# EAGLE design espscrew12e (EAGLE 7.6.0)
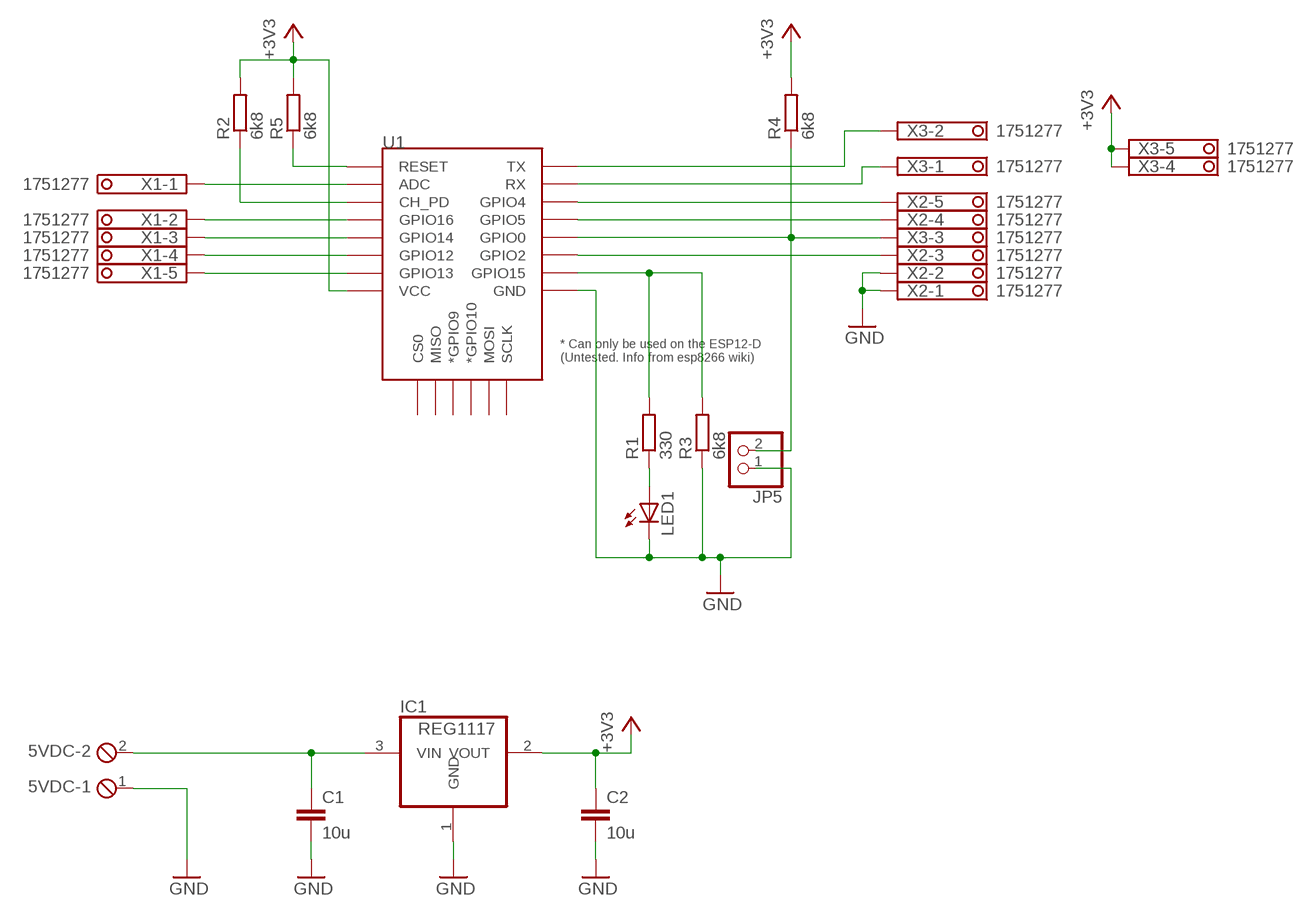
[diagram p0: schematic, sheet 1]

## Parts
5VDC  MPT2  [2POL254]
C1  10u  C-EUC1206K  [C1206K]
C2  10u  C-EUC1206K  [C1206K]
IC1  REG1117  [SOT223]
JP5  PINHD-1X2  [1X02]
LED1  LEDSML1206  [SML1206]
R1  330  R-EU_R1206  [R1206]
R2  6k8  R-EU_R1206  [R1206]
R3  6k8  R-EU_R1206  [R1206]
R4  6k8  R-EU_R1206  [R1206]
R5  6k8  R-EU_R1206  [R1206]
U1  ESP12ESMD  [ESP12E-SMD]
X1  1751277  [1751277]
X2  1751277  [1751277]
X3  1751277  [1751277]

## Nets
+3V3: C2.1 IC1.2(VOUT) R2.2 R4.2 R5.2 U1.VCC X3.4 X3.5
GND: 5VDC.1 C1.2 C2.2 IC1.1(GND) JP5.1 LED1.C R3.1 U1.GND X2.1 X2.2
N$1: 5VDC.2 C1.1 IC1.3(VIN)
N$2: LED1.A R1.1
N$3: R5.1 U1.RESET
N$4: U1.ADC X1.1
N$5: R2.1 U1.CH_PD
N$6: U1.GPIO16 X1.2
N$7: U1.GPIO14 X1.3
N$8: U1.GPIO12 X1.4
N$9: U1.GPIO13 X1.5
N$11: U1.TXD0(TX) X3.2
N$12: U1.RXD0(RX) X3.1
N$13: U1.GPIO4 X2.5
N$14: U1.GPIO5 X2.4
N$15: JP5.2 R4.1 U1.GPIO0 X3.3
N$16: U1.GPIO2 X2.3
N$17: R1.2 R3.2 U1.GPIO15
Unconnected: U1.CS0 U1.GPIO9(*GPIO9) U1.GPIO10(*GPIO10) U1.MISO U1.MOSI U1.SCLK

## Library data of the parts
5VDC = con-phoenix-254:MPT2: PHOENIX CONNECTOR; OC_FARNELL: unknown; OC_NEWARK: unknown
C1 C2 = rcl:C-EU: CAPACITOR, European symbol
IC1 = burr-brown:REG1117: 800mA and 1A Low Dropout (LDO) Positive Regulator 1.8V, 2.5V, 2.85V, 3.3V, 5V, and Adj; MPN: REG1117; OC_FARNELL: 1097566; OC_NEWARK: 14P6981
JP5 = pinhead:PINHD-1X2: PIN HEADER
LED1 = led:LED: LED OSRAM: - CHIPLED LG R971, LG N971, LY N971, LG Q971, LY Q971, LO R971, LY R971 LH N974, LH R974 LS Q976, LO Q976, LY Q976 LO Q996 - Hyper CHIPLED LW Q18S LB Q993, LB Q99A, LB R99A - SideLED LS A670, LO A670, LY A670, LG A670, LP A670 LB A673, LV A673, LT A673, LW A673 LH A674 LY A675 LS A676, LA A676, LO A676, LY A676, LW A676 LS A679, LY A679, LG A679 - Hyper Micro SIDELED® LS Y876, LA Y876, LO Y876, LY Y876 LT Y87S - SmartLED LW L88C, LW L88S LB L89C, LB L89S, LG L890 LS L89K, LO L89K, LY L89K LS L896, LA L896, LO L896, LY L896 - TOPLED LS T670, LO T670, LY T670, LG T670, LP T670 LSG T670, LSP T670, LSY T670, LOP T670, LYG T670 LG T671, LOG T671, LSG T671 LB T673, LV T673, LT T673, LW T673 LH T674 LS T676, LA T676, LO T676, LY T676, LB T676, LH T676, LSB T676, LW T676 LB T67C, LV T67C, LT T67C, LS T67K, LO T67K, LY T67K, LW E67C LS E67B, LA E67B, LO E67B, LY E67B, LB E67C, LV E67C, LT E67C LW T67C LS T679, LY T679, LG T679 LS T770, LO T770, LY T770, LG T770, LP T770 LB T773, LV T773, LT T773, LW T773 LH T774 LS E675, LA E675, LY E675, LS T675 LS T776, LA T776, LO T776, LY T776, LB T776 LHGB T686 LT T68C, LB T68C - Hyper Mini TOPLED® LB M676 - Mini TOPLED Santana® LG M470 LS M47K, LO M47K, LY M47K Source: http://www.osram.convergy.de LUXEON: - LUMILED® LXK2-PW12-R00, LXK2-PW12-S00, LXK2-PW14-U00, LXK2-PW14-V00 LXK2-PM12-R00, LXK2-PM12-S00, LXK2-PM14-U00 LXK2-PE12-Q00, LXK2-PE12-R00, LXK2-PE12-S00, LXK2-PE14-T00, LXK2-PE14-U00 LXK2-PB12-K00, LXK2-PB12-L00, LXK2-PB12-M00, LXK2-PB14-N00, LXK2-PB14-P00, LXK2-PB14-Q00 LXK2-PR12-L00, LXK2-PR12-M00, LXK2-PR14-Q00, LXK2-PR14-R00 LXK2-PD12-Q00, LXK2-PD12-R00, LXK2-PD12-S00 LXK2-PH12-R00, LXK2-PH12-S00 LXK2-PL12-P00, LXK2-PL12-Q00, LXK2-PL12-R00 Source: www.luxeon.com KINGBRIGHT: KA-3528ASYC Source: www.kingbright.com
R1-R5 = resistor:R-EU_: RESISTOR, European symbol
U1 = esp8266modules:ESP12E: ESP12E Module
X1-X3 = con-phoenix-350:1751277: MKDS 1/ 5-3,5 Printklemme Nennstrom: 10 A Bemessungsspannung: 160 V Raster: 3,5 mm Polzahl: 5 Montageart: Löten Anschlussart: Schraubanschluss Anschlussrichtung vom Leiter zur Platine: 0° Source: http://eshop.phoenixcontact.com .. 1751277.pdf; OC_FARNELL: unknown; OC_NEWARK: unknown

## Board
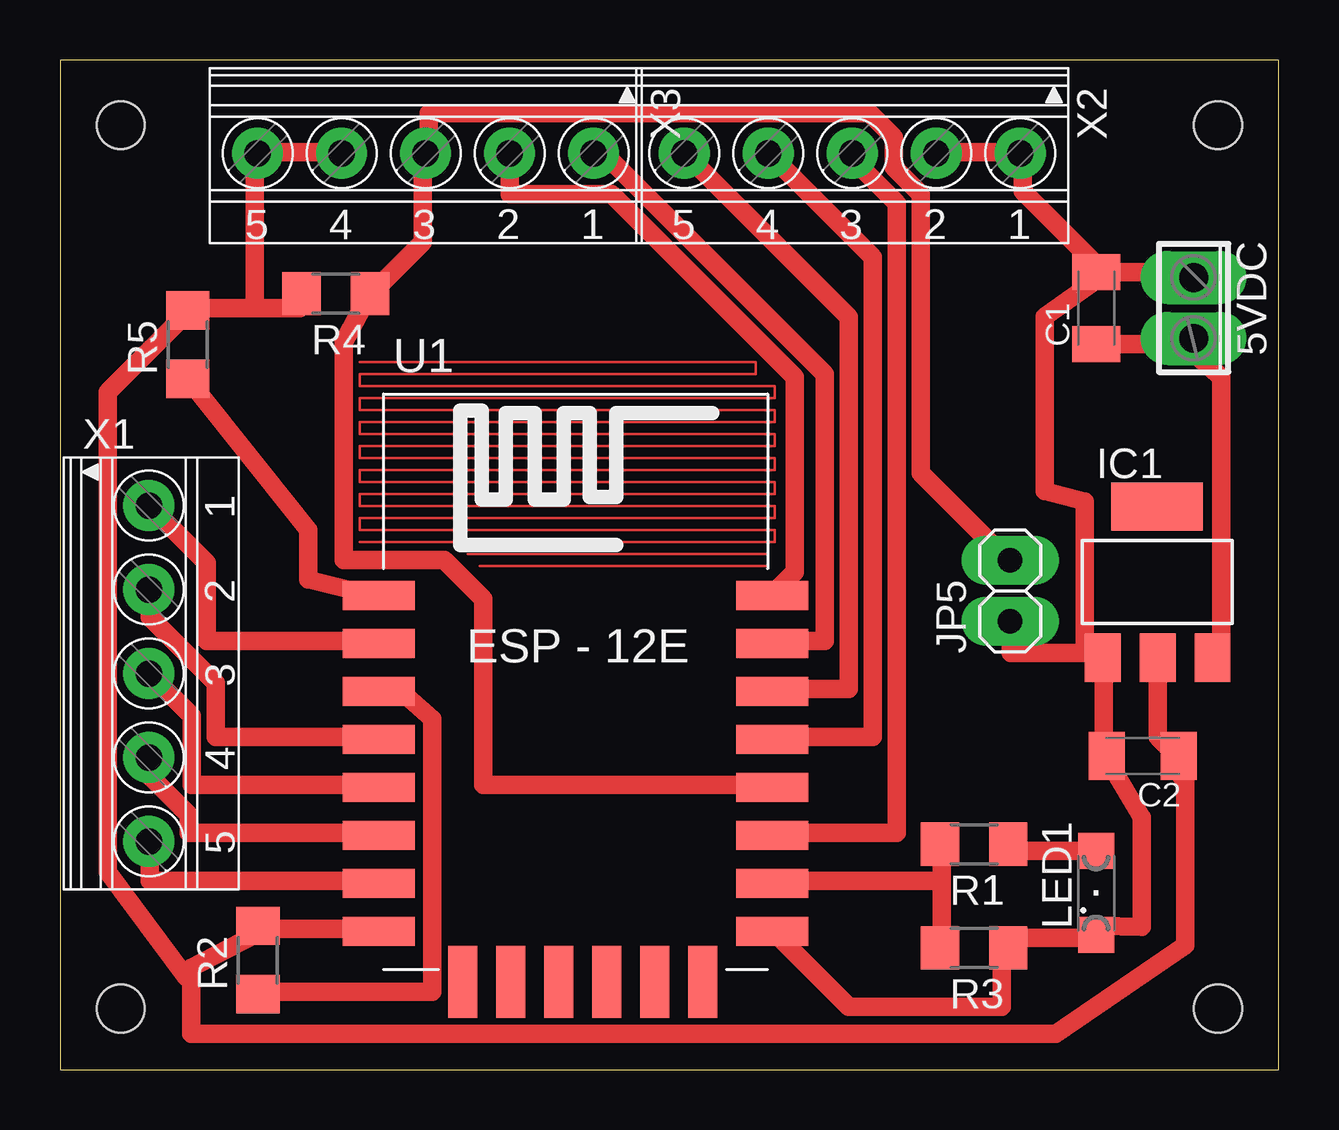
[diagram p1: board, top side]

Size 50.79 x 42.09 mm. Coordinates in mm from the lower left corner, seen from the top.
Outline: 50.79,0 50.79,42.09 0,42.09 0,0 50.79,0
Copper layers (1*16): Top 0.035mm / dielectric 1.5mm / Bottom 0.035mm
Design rules "default *": minimum track width 30mil, minimum drill 24mil, track to track 8mil, track to pad 8mil, pad to pad 8mil, via to via 8mil, smd to smd 8mil, copper to edge 40mil, drill to drill 8mil, minimum pad ring 20mil, minimum via ring 20mil, stop-mask expansion 4mil, vias tented up to drill 0mil, thermal gap 10mil
Holes 2 mm at 48.25,2.54 48.25,39.37 2.53,39.37 2.53,2.54

### Footprints (pad centres in the part's own frame; a part is rotated, then mirrored left to right if it is on the bottom)
2POL254 = drill 1.2 long: 1 -1.27,0; 2 1.27,0
C1206K = smd 1.5 x 2: 1 -1.5,0; 2 1.5,0
SOT223 = smd 1.499 x 2.007: 1 -2.261,-3.15; 2 0.025,-3.15; 3 2.311,-3.15 | smd 3.81 x 2.007: 4 0,3.15
1X02 = drill 1.016 long: 1 -1.27,0; 2 1.27,0
SML1206 = smd 1.5 x 1.5: A 1.75,0; C -1.75,0
R1206 = smd 1.6 x 1.803: 1 -1.422,0; 2 1.422,0
ESP12E-SMD = smd 3 x 1.2: ADC -8.3,3.8; CH_PD -8.3,1.8; GND 8.1,-8.2; GPIO0 8.1,-2.2; GPIO2 8.1,-4.2; GPIO4 8.1,1.8; GPIO5 8.1,-0.2; GPIO12 -8.3,-4.2; GPIO13 -8.3,-6.2; GPIO14 -8.3,-2.2; GPIO15 8.1,-6.2; GPIO16 -8.3,-0.2; RESET -8.3,5.8; RXD0 8.1,3.8; TXD0 8.1,5.8; VCC -8.3,-8.2 | smd 1.2 x 3: CS0 -4.8,-10.3; GPIO9 -0.8,-10.3; GPIO10 1.2,-10.3; MISO -2.8,-10.3; MOSI 3.2,-10.3; SCLK 5.2,-10.3
1751277 = drill 1.1 pad 1.7: 1 -7,-0.1; 2 -3.5,-0.1; 3 0,-0.1; 4 3.5,-0.1; 5 7,-0.1

### Placement (x,y rotation side)
5VDC  47.23,31.75 270 top
C1  43.17,31.75 90 top
C2  45.11,13.07 180 top
IC1  45.71,20.32 0 top
JP5  39.59,19.96 90 top
LED1  43.17,7.37 90 top
R1  38.09,9.4 180 top
R2  8.25,4.57 90 top
R3  38.09,5.08 180 top
R4  11.49,32.35 180 top
R5  5.32,30.23 90 top
U1  21.58,13.97 0 top
X1  3.8,16.51 270 top
X2  33.01,38.1 180 top
X3  15.23,38.1 180 top

### Tracks (layer width: path | path; a pad name or v marks a point on that pad's centre or on a via)
+3V3
  Top 0.762: 8.12,31.75 9.99,31.75 9.99,32.25 R4.2 | 8.12,31.75 5.37,31.75 R5.2 5.12,31.38 1.99,28.25 1.99,8.25 5.25,3.88 5.47,3.88 | 8.12,31.75 8.12,38.12 X3.5 8.62,38.25 11.62,38.25 X3.4 | IC1.2 45.74,17.12 45.74,13.88 46.49,13.12 C2.1 46.37,12.75 46.89,12 46.89,5.17 41.49,1.5 5.47,1.5 5.47,3.88 | U1.VCC 13.24,5.88 8.37,5.88 R2.2 8.12,5.62 5.47,4.25 5.47,3.88
GND
  Top 0.762: C1.2 47.12,33.25 47.12,33.12 5VDC.1 | X2.2 36.62,38.25 39.99,38.25 X2.1 40.12,37.88 40.12,36.62 43.12,33.62 C1.2 | 42.69,17.38 39.62,17.38 39.62,18.62 JP5.1 | 42.69,17.38 43.12,17.38 IC1.1 43.49,17.12 43.49,13.12 C2.2 43.74,12.75 45.07,10.53 45.07,5.96 43.24,6 LED1.C 43.12,5.5 39.62,5.5 39.62,5.12 R3.1 39.24,4.88 39.24,2.62 32.87,2.62 29.74,5.75 U1.GND | 42.69,17.38 42.69,23.68 41.04,24.12 41.04,31.4 43.12,32.88 C1.2
N$1
  Top 0.762: C1.1 47.12,30.25 47.12,30.38 5VDC.2 47.24,29.88 48.39,28.88 48.39,17.38 48.12,17.25 IC1.3
N$2
  Top 0.762: LED1.A 43.12,9.12 39.62,9.12 39.62,9.38 R1.1
N$3
  Top 0.762: R5.1 5.37,28.75 10.35,22.5 10.35,20.43 12.62,19.88 13.24,19.88 U1.RESET
N$4
  Top 0.762: U1.ADC 13.24,17.88 6.12,17.88 6.12,21.12 3.74,23.5 X1.1
N$5
  Top 0.762: R2.1 8.37,3.25 15.52,3.25 15.52,14.62 14.24,15.75 13.37,15.75 U1.CH_PD
N$6
  Top 0.762: U1.GPIO16 13.24,13.88 6.49,13.88 6.49,16.12 3.74,18.88 3.74,20 X1.2
N$7
  Top 0.762: U1.GPIO14 13.24,11.88 5.49,11.88 5.49,14.75 3.74,16.5 X1.3
N$8
  Top 0.762: U1.GPIO12 13.24,9.88 5.37,9.88 5.37,10.62 3.74,12.25 3.74,13 X1.4
N$9
  Top 0.762: U1.GPIO13 13.24,7.88 3.74,7.88 3.74,9.5 X1.5
N$10
  Top 0.1: 12.49,29.5 28.99,29.5 28.99,29 12.49,29 12.49,28.5 29.79,28.5 29.79,28 12.49,28 12.49,27.5 29.79,27.5 29.79,27 12.49,27 12.49,26.5 29.79,26.5 29.79,26 12.49,26 12.49,25.5 29.79,25.5 29.79,25 12.49,25 12.49,24.5 29.79,24.5 29.79,24 12.49,24 12.49,23.5 29.79,23.5 29.79,23 12.49,23 12.49,22.5 29.79,22.5 29.79,22 12.49,22
N$11
  Top 0.762: U1.TXD0 29.74,19.88 30.61,20.75 30.61,28.88 22.99,36.5 18.74,36.5 18.74,38.12 X3.2
N$12
  Top 0.762: U1.RXD0 29.74,17.88 31.86,17.88 31.86,29 22.74,38.12 22.24,38.12 X3.1
N$13
  Top 0.762: U1.GPIO4 29.74,15.88 32.87,15.88 32.87,31.38 26.11,38.12 X2.5
N$14
  Top 0.762: U1.GPIO5 29.74,13.88 33.87,13.88 33.87,33.88 29.61,38.12 X2.4
N$15
  Top 0.762: U1.GPIO0 29.61,11.88 17.63,11.88 17.63,19.62 16.01,21.25 11.81,21.25 11.81,30.32 R4.1 12.99,32.38 15.12,34.5 15.12,38.12 X3.3 15.37,38.5 15.37,39.88 33.74,39.88 34.74,38.88 34.74,37.62 35.87,36.5 35.87,24.88 39.49,21.25 JP5.2
N$16
  Top 0.762: U1.GPIO2 29.74,9.88 34.87,9.88 34.87,36.12 33.12,37.88 33.12,38.12 X2.3
N$17
  Top 0.762: 36.74,7.88 36.74,9.38 R1.2 | 36.74,7.88 36.74,5.12 R3.2 | 36.74,7.88 29.74,7.88 U1.GPIO15
N$18
  Top 0.1: 16.99,21.5 29.49,21.5 29.49,21 17.49,21